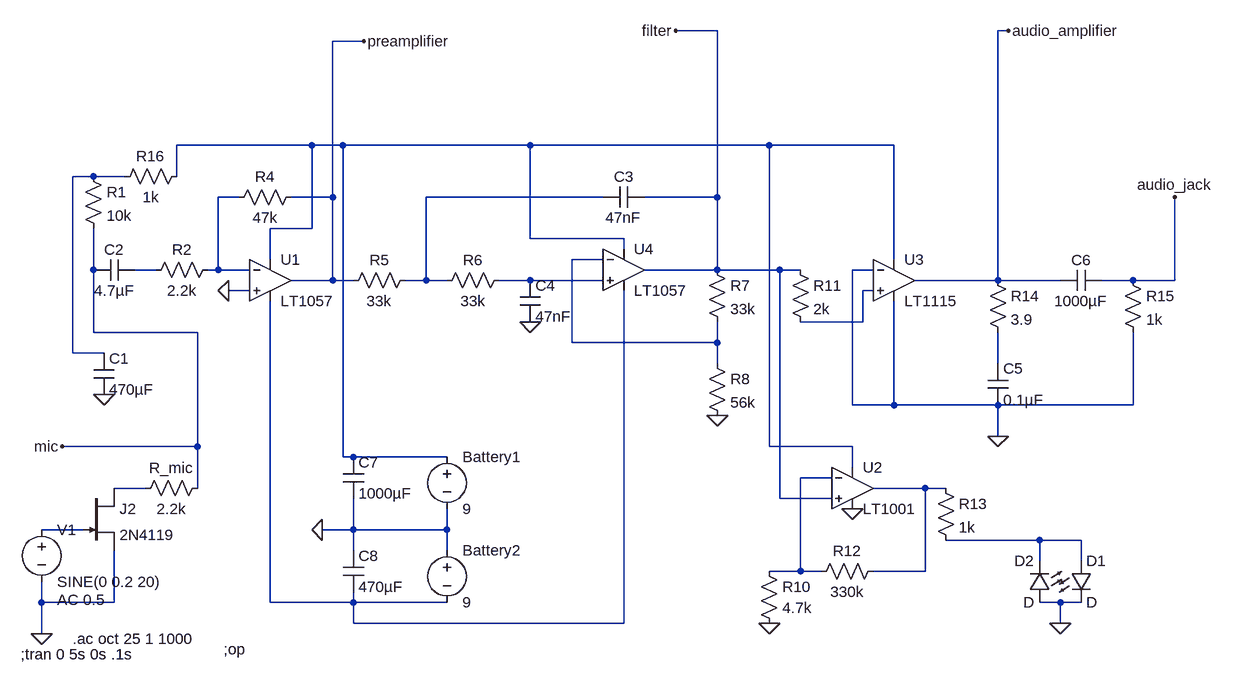
[diagram p0: schematic ste-hp.asc]
ste-hp.asc, the LTspice schematic file:
Version 4
SHEET 1 1016 680
WIRE 224 -336 160 -336
WIRE 672 -336 656 -336
WIRE -320 -320 -368 -320
WIRE -400 -160 -608 -160
WIRE -352 -160 -400 -160
WIRE -64 -160 -352 -160
WIRE 304 -160 -64 -160
WIRE 496 -160 304 -160
WIRE -736 -112 -768 -112
WIRE -688 -112 -736 -112
WIRE -608 -112 -608 -160
WIRE -512 -80 -544 -80
WIRE -368 -80 -368 -320
WIRE -368 -80 -432 -80
WIRE 48 -80 -224 -80
WIRE 224 -80 224 -336
WIRE 224 -80 112 -80
WIRE -400 -32 -400 -160
WIRE -400 -32 -464 -32
WIRE -64 -16 -64 -160
WIRE 80 -16 -64 -16
WIRE 80 0 80 -16
WIRE -464 16 -464 -32
WIRE 48 16 0 16
WIRE 496 16 496 -160
WIRE -736 32 -736 -32
WIRE -640 32 -672 32
WIRE -544 32 -544 -80
WIRE -544 32 -560 32
WIRE -496 32 -544 32
WIRE 224 32 224 -80
WIRE 224 32 112 32
WIRE 320 32 224 32
WIRE 352 32 320 32
WIRE 464 32 432 32
WIRE -368 48 -368 -80
WIRE -368 48 -432 48
WIRE -336 48 -368 48
WIRE -224 48 -224 -80
WIRE -224 48 -256 48
WIRE -192 48 -224 48
WIRE -64 48 -112 48
WIRE 48 48 -64 48
WIRE 656 48 656 -336
WIRE 656 48 528 48
WIRE 752 48 656 48
WIRE 864 48 816 48
WIRE 928 48 928 -80
WIRE 928 48 864 48
WIRE -496 64 -528 64
WIRE 464 64 448 64
WIRE 448 112 448 64
WIRE 448 112 352 112
WIRE -736 128 -736 32
WIRE -576 128 -736 128
WIRE 0 144 0 16
WIRE 224 144 224 112
WIRE 224 144 0 144
WIRE -768 160 -768 -112
WIRE -720 160 -768 160
WIRE 224 176 224 144
WIRE 656 176 656 128
WIRE 432 240 432 32
WIRE 496 240 496 80
WIRE 496 240 432 240
WIRE 656 240 496 240
WIRE 864 240 864 128
WIRE 864 240 656 240
WIRE 656 288 656 240
WIRE -576 304 -576 128
WIRE -576 304 -784 304
WIRE 304 304 304 -160
WIRE 432 304 304 304
WIRE -352 320 -352 -160
WIRE -336 320 -352 320
WIRE -192 320 -336 320
WIRE 432 336 432 304
WIRE 400 352 352 352
WIRE -656 368 -704 368
WIRE -576 368 -576 304
WIRE 544 368 464 368
WIRE 576 368 544 368
WIRE 320 384 320 32
WIRE 400 384 320 384
WIRE -752 432 -816 432
WIRE -336 432 -336 384
WIRE -336 432 -384 432
WIRE -192 432 -192 400
WIRE -192 432 -336 432
WIRE 720 448 576 448
WIRE 784 448 720 448
WIRE -336 464 -336 432
WIRE -192 464 -192 432
WIRE 720 480 720 448
WIRE 784 480 784 448
WIRE 352 496 352 352
WIRE 352 496 304 496
WIRE 384 496 352 496
WIRE 544 496 544 368
WIRE 544 496 464 496
WIRE -816 544 -816 512
WIRE -704 544 -704 464
WIRE -704 544 -816 544
WIRE -464 544 -464 80
WIRE -336 544 -336 528
WIRE -336 544 -464 544
WIRE -192 544 -336 544
WIRE 752 544 720 544
WIRE 784 544 752 544
WIRE -336 576 -336 544
WIRE 80 576 80 64
WIRE 80 576 -336 576
WIRE 752 576 752 544
WIRE -816 592 -816 544
FLAG -384 432 0
FLAG -64 112 0
FLAG 224 256 0
FLAG 656 288 0
FLAG -720 224 0
FLAG 752 576 0
FLAG 304 576 0
FLAG -528 64 0
FLAG -816 592 0
FLAG 928 -80 audio_jack
FLAG -784 304 mic
FLAG -320 -320 preamplifier
FLAG 160 -336 filter
FLAG 672 -336 audio_amplifier
FLAG 432 400 0
SYMBOL Opamps\\LT1057 -464 -16 R0
SYMATTR InstName U1
SYMBOL Opamps\\LT1001 432 304 R0
SYMATTR InstName U2
SYMBOL Opamps\\LT1115 496 -16 R0
SYMATTR InstName U3
SYMBOL res -656 48 R270
WINDOW 0 32 56 VTop 2
WINDOW 3 0 56 VBottom 2
SYMATTR InstName R2
SYMATTR Value 2.2k
SYMBOL res -752 -128 R0
SYMATTR InstName R1
SYMATTR Value 10k
SYMBOL res -704 -96 R270
WINDOW 0 32 56 VTop 2
WINDOW 3 0 56 VBottom 2
SYMATTR InstName R16
SYMATTR Value 1k
SYMBOL res -352 64 R270
WINDOW 0 32 56 VTop 2
WINDOW 3 0 56 VBottom 2
SYMATTR InstName R5
SYMATTR Value 33k
SYMBOL res -96 32 R90
WINDOW 0 0 56 VBottom 2
WINDOW 3 32 56 VTop 2
SYMATTR InstName R6
SYMATTR Value 33k
SYMBOL cap -80 48 R0
SYMATTR InstName C4
SYMATTR Value 47nF
SYMBOL cap 112 -96 R90
WINDOW 0 0 32 VBottom 2
WINDOW 3 32 32 VTop 2
SYMATTR InstName C3
SYMATTR Value 47nF
SYMBOL cap -672 16 R90
WINDOW 0 0 32 VBottom 2
WINDOW 3 32 32 VTop 2
SYMATTR InstName C2
SYMATTR Value 4.7µF
SYMBOL cap 816 32 R90
WINDOW 0 0 32 VBottom 2
WINDOW 3 32 32 VTop 2
SYMATTR InstName C6
SYMATTR Value 1000µF
SYMBOL cap 640 176 R0
SYMATTR InstName C5
SYMATTR Value 0.1µF
SYMBOL Opamps\\LT1057 80 -32 R0
SYMATTR InstName U4
SYMBOL res 208 16 R0
SYMATTR InstName R7
SYMATTR Value 33k
SYMBOL res 336 16 R0
SYMATTR InstName R11
SYMATTR Value 2k
SYMBOL res 208 160 R0
SYMATTR InstName R8
SYMATTR Value 56k
SYMBOL res 288 480 R0
WINDOW 3 36 72 Left 2
SYMATTR Value 4.7k
SYMATTR InstName R10
SYMBOL res 640 32 R0
SYMATTR InstName R14
SYMATTR Value 3.9
SYMBOL res 560 352 R0
SYMATTR InstName R13
SYMATTR Value 1k
SYMBOL res 480 480 R90
WINDOW 0 0 56 VBottom 2
WINDOW 3 32 56 VTop 2
SYMATTR InstName R12
SYMATTR Value 330k
SYMBOL res 848 32 R0
SYMATTR InstName R15
SYMATTR Value 1k
SYMBOL LED 768 480 R0
SYMATTR InstName D1
SYMBOL LED 736 544 R180
WINDOW 0 24 64 Left 2
WINDOW 3 24 0 Left 2
SYMATTR InstName D2
SYMBOL cap -736 160 R0
SYMATTR InstName C1
SYMATTR Value 470µF
SYMBOL voltage -192 304 R0
WINDOW 123 0 0 Left 2
WINDOW 39 0 0 Left 2
SYMATTR InstName Battery1
SYMATTR Value 9
SYMBOL voltage -192 448 R0
WINDOW 123 0 0 Left 2
WINDOW 39 0 0 Left 2
SYMATTR InstName Battery2
SYMATTR Value 9
SYMBOL cap -352 320 R0
SYMATTR InstName C7
SYMATTR Value 1000µF
SYMBOL cap -352 464 R0
SYMATTR InstName C8
SYMATTR Value 470µF
SYMBOL res -416 -96 R90
WINDOW 0 0 56 VBottom 2
WINDOW 3 32 56 VTop 2
SYMATTR InstName R4
SYMATTR Value 47k
SYMBOL njf -752 368 R0
SYMATTR InstName J2
SYMATTR Value 2N4119
SYMBOL voltage -816 416 R0
WINDOW 123 24 124 Left 2
WINDOW 39 0 0 Left 2
SYMATTR Value2 AC 0.5
SYMATTR InstName V1
SYMATTR Value SINE(0 0.2 20)
SYMBOL res -560 352 R90
WINDOW 0 0 56 VBottom 2
WINDOW 3 32 56 VTop 2
SYMATTR InstName R_mic
SYMATTR Value 2.2k
TEXT -768 600 Left 2 !.ac oct 25 1 1000
TEXT -848 624 Left 2 !;tran 0 5s 0s .1s
TEXT -536 616 Left 2 !;op

The netlist it stands for:
* ste-hp.asc
XU1 0 N003 N001 N015 preamplifier LT1057  ; pins In+ In- V+ V- OUT
XU2 filter N010 N001 0 N012 LT1001  ; pins In+ In- V+ V- OUT
XU3 N008 0 N001 0 audio_amplifier LT1028  ; LT1115, pins In+ In- V+ V- OUT
R2 N006 N003 2.2k
R1 N002 mic 10k
R16 N002 N001 1k
R5 preamplifier N004 33k
R6 N007 N004 33k
C4 N007 0 47nF
C3 filter N004 47nF
C2 N006 mic 4.7µF
C6 audio_jack audio_amplifier 1000µF
C5 N009 0 0.1µF
XU4 N007 N005 N001 N015 filter LT1057  ; pins In+ In- V+ V- OUT
R7 filter N005 33k
R11 filter N008 2k
R8 N005 0 56k
R10 N010 0 4.7k
R14 audio_amplifier N009 3.9
R13 N012 N014 1k
R12 N012 N010 330k
R15 audio_jack 0 1k
D1 N014 0 D
D2 0 N014 D
C1 N002 0 470µF
V§Battery1 N001 0 9
V§Battery2 0 N015 9
C7 N001 0 1000µF
C8 0 N015 470µF
R4 preamplifier N003 47k
J2 N011 N013 0 2N4119
V1 N013 0 SINE(0 0.2 20) AC 0.5
R_mic mic N011 2.2k
.model D D
.lib standard.dio
.model NJF NJF
.model PJF PJF
.lib standard.jft
.ac oct 25 1 1000
;tran 0 5s 0s .1s
;op
.lib LTC.lib
.backanno
.end